# Altium schematic sheet LED Driver.SchDoc
size A4
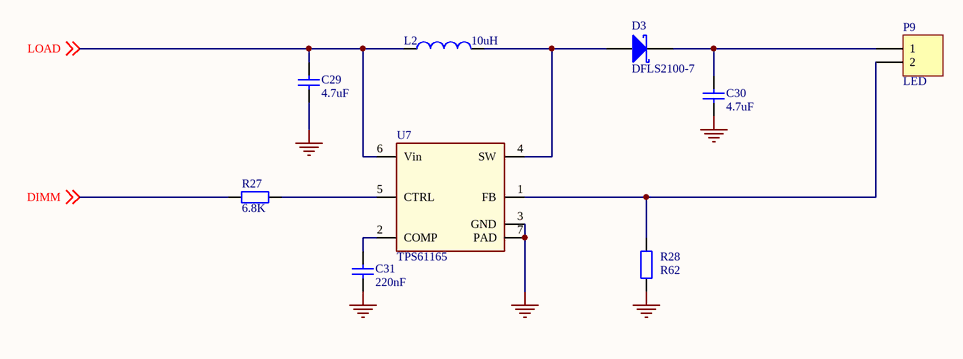
[diagram p0: LED Driver.SchDoc]

## Parts
C29  value 4.7uF  [C0805]  (hidden comment: Capacitor ceramic)
C30  value 4.7uF  [C0805]  (hidden comment: Capacitor ceramic)
C31  value 220nF  [C0402]  (hidden comment: Capacitor ceramic)
D3  DFLS2100-7  [PowerDI123]
L2  value 10uH  [LQH3NP]  (hidden comment: Power Inductor)
P9  LED  [TERM2pin5mm]
R27  value 6.8K  [R0402]  (hidden comment: Resistor)
R28  value R62  [R1206]  (hidden comment: Resistor)
U7  TPS61165  [QFN-6_custom]

## Nets
GND: C29.2 C30.2 C31.2 R28.1 U7.3(GND) U7.7(PAD)
DIMM: R27.1 ; off-sheet DIMM
LOAD: C29.1 L2.1 U7.6(Vin) ; off-sheet LOAD
NetC30_1: C30.1 D3.2(K) P9.1
NetC31_1: C31.1 U7.2(COMP)
NetD3_1: D3.1(A) L2.2 U7.4(SW)
NetP9_2: P9.2 R28.2 U7.1(FB)
NetR27_2: R27.2 U7.5(CTRL)

## Library data of the parts
C29 C30 = Cap: Manufacturer: Murata Electronics; Manufacturer Part No.: GRM219R6YA475KA73D; Part Description: Ceramic Capacitor; Specification: X5R, 35V, 10%; Link: https://www.digikey.com/product-detail/en/murata-electronics/GRM219R6YA475KA73D/490-7208-1-ND/3900454; Supplier: DigiKey; Supplier part number: 490-7208-1-ND
C31 = Cap: Manufacturer: Yageo; Manufacturer Part No.: CC0402KRX5R8BB224; Part Description: Ceramic Capacitor; Specification: X5R, 25V, 10%; Link: https://www.digikey.com/product-detail/en/yageo/CC0402KRX5R8BB224/311-3341-1-ND/6818311; Supplier: DigiKey; Supplier part number: 311-3341-1-ND
D3 = D Schottky: Schottky Diode; Manufacturer: Diodes Incorporated; Part Description: DIODE SCHOTTKY; Specification: 100V, 2A; Link: https://www.digikey.com/product-detail/en/diodes-incorporated/DFLS2100-7/DFLS2100-7DICT-ND/3451552; Value: DFLS2100-7; Manufacturer Part No.: DFLS2100-7; Supplier: DigiKey; Supplier part number: DFLS2100-7DICT-ND
L2 = Inductor: Manufacturer: Murata Electronics; Manufacturer Part No.: LQH3NPN100MMEL; Specification: 0.8A, 20%; Link: https://www.digikey.com/product-detail/en/murata-electronics/LQH3NPN100MMEL/490-15945-1-ND/6800610; Part Description: Power Inductor; Supplier: DigiKey; Supplier part number: 490-15945-1-ND
P9 = Header 2: Header, 2-Pin; Manufacturer: SAURO; Part Description: Terminal block; Value: MSG02001; Specification: 2pos. 5mm,  24A, 300V; Link: https://www.sauro.net/products/MSG02001/?product_id=MSG02001; Manufacturer Part No.: MSG02001; Supplier: Rutronik; Supplier part number: COTERM5720
R27 = Res2: Manufacturer: Yageo; Manufacturer Part No.: RC0402JR-076K8L; Part Description: Thick Film Resistor; Specification: 5% 0,063W; Link: https://www.digikey.com/product-detail/en/yageo/RC0402JR-076K8L/311-6-8KJRCT-ND/729444; Supplier: DigiKey; Supplier part number: 311-6.8KJRCT-ND
R28 = Res2: Manufacturer: Panasonic Electronic Components; Manufacturer Part No.: ERJ-8RQFR62V; Part Description: Thick Film Resistor; Specification: 1% 0.25W; Link: https://www.digikey.com/product-detail/en/panasonic-electronic-components/ERJ-8RQFR62V/P-62RCT-ND/3982353; Supplier: DigiKey; Supplier part number: P.62RCT-ND
U7 = TPS61165: HBLED Driver; Manufacturer: TI; Part Description: Boost LED DRiver; Value: TPS61165DRVT; Specification: 18V in, 38V, 350mA; Link: https://www.digikey.com/product-detail/en/texas-instruments/TPS61165DRVT/296-27015-1-ND/2255302; Manufacturer Part No.: TPS61165DRVT; Supplier: DigiKey; Supplier part number: 296-27015-1-ND